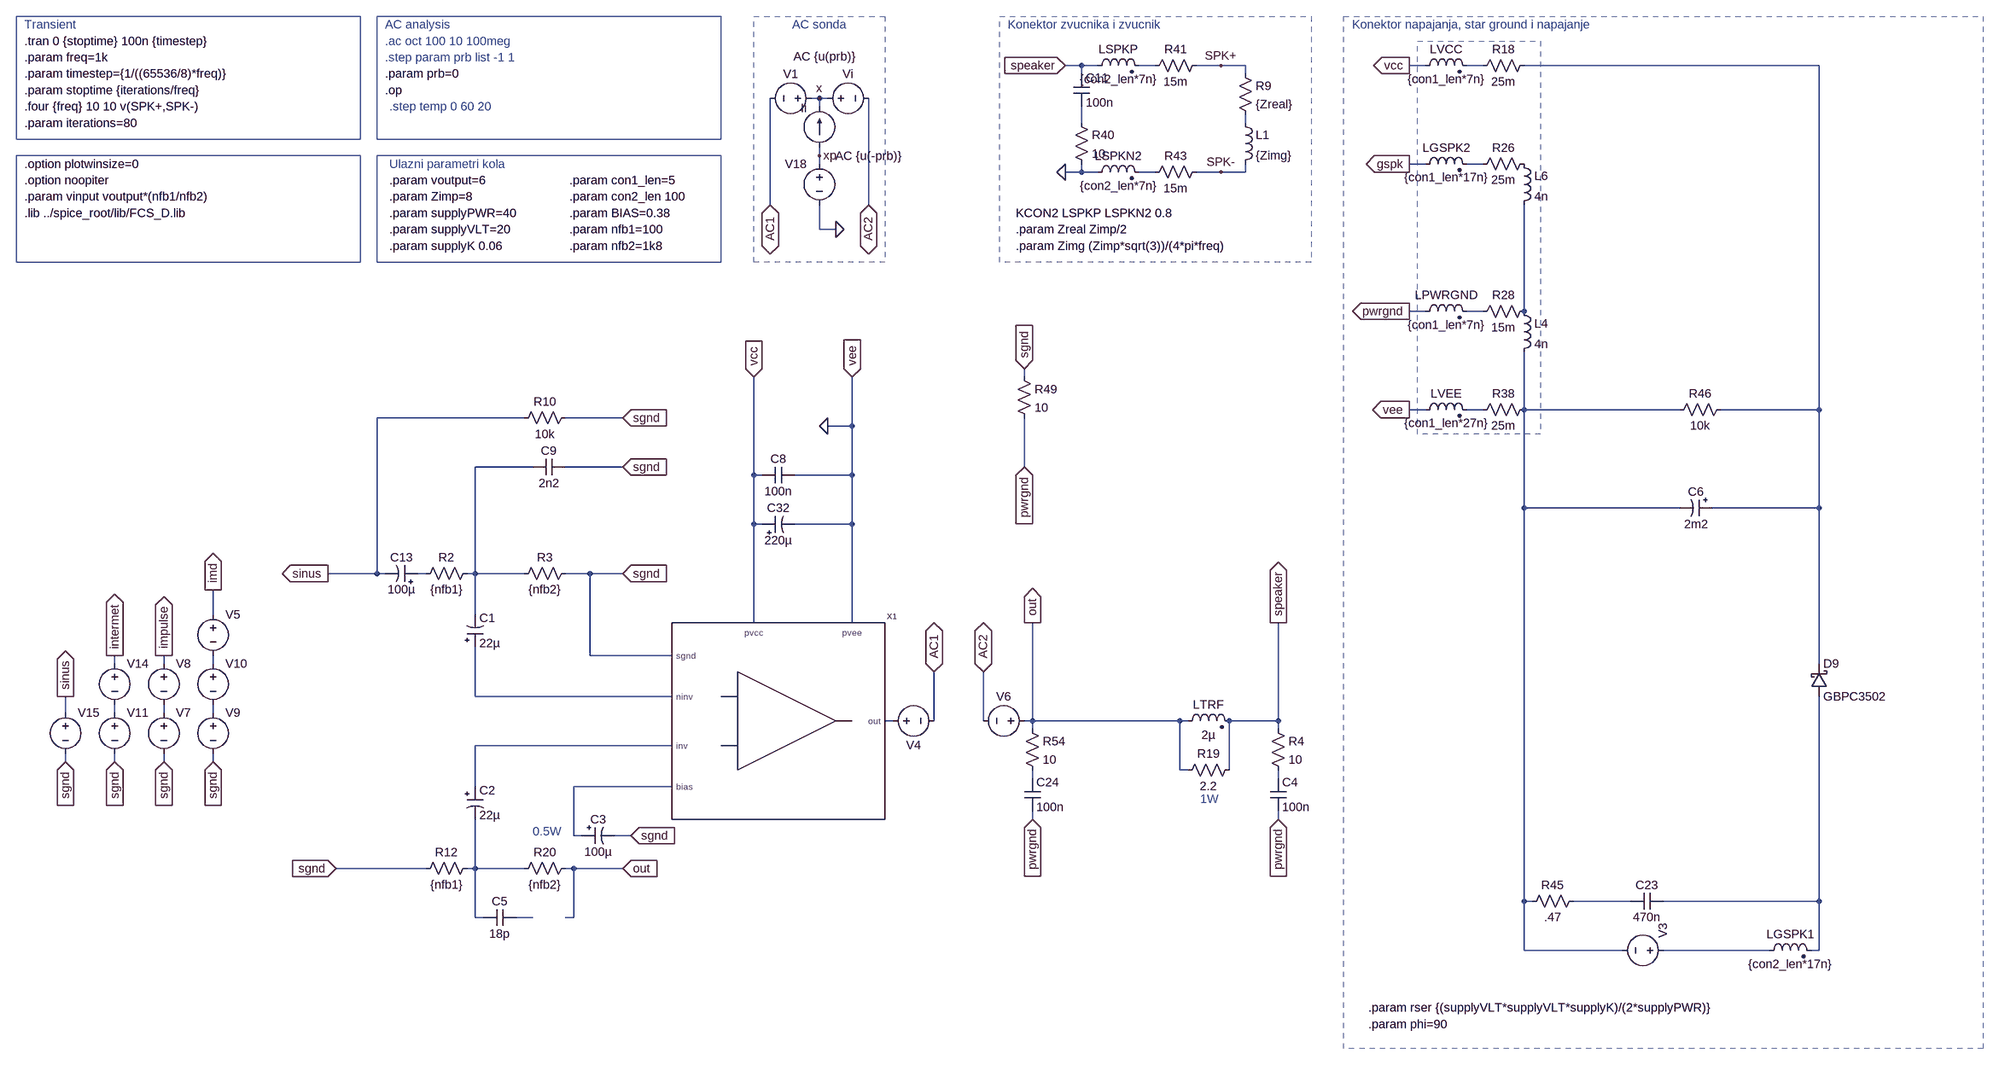
[diagram p0: schematic pab3bbb-sewa.asc]
pab3bbb-sewa.asc, the LTspice schematic file:
Version 4
SHEET 1 6124 2336
WIRE 1504 -1536 1472 -1536
WIRE 1536 -1536 1504 -1536
WIRE 1648 -1536 1616 -1536
WIRE 1776 -1536 1728 -1536
WIRE 1824 -1536 1776 -1536
WIRE 2176 -1536 2144 -1536
WIRE 2288 -1536 2256 -1536
WIRE 2944 -1536 2368 -1536
WIRE 1504 -1520 1504 -1536
WIRE 1824 -1520 1824 -1536
WIRE 992 -1472 976 -1472
WIRE 1008 -1472 992 -1472
WIRE 992 -1456 992 -1472
WIRE 1504 -1424 1504 -1456
WIRE 1824 -1424 1824 -1440
WIRE 992 -1360 992 -1376
WIRE 992 -1344 992 -1360
WIRE 2176 -1344 2144 -1344
WIRE 2288 -1344 2256 -1344
WIRE 1504 -1328 1504 -1344
WIRE 1504 -1328 1472 -1328
WIRE 1536 -1328 1504 -1328
WIRE 1648 -1328 1616 -1328
WIRE 1776 -1328 1728 -1328
WIRE 1824 -1328 1824 -1344
WIRE 1824 -1328 1776 -1328
WIRE 896 -1264 896 -1472
WIRE 1088 -1264 1088 -1472
WIRE 992 -1216 992 -1264
WIRE 1024 -1216 992 -1216
WIRE 2176 -1056 2144 -1056
WIRE 2288 -1056 2256 -1056
WIRE 2368 -1056 2368 -1264
WIRE 1392 -928 1392 -944
WIRE 2176 -864 2144 -864
WIRE 2288 -864 2256 -864
WIRE 2368 -864 2368 -976
WIRE 2672 -864 2368 -864
WIRE 2944 -864 2944 -1536
WIRE 2944 -864 2752 -864
WIRE 416 -848 128 -848
WIRE 608 -848 496 -848
WIRE 1056 -832 1056 -928
WIRE 1056 -832 1008 -832
WIRE 432 -752 320 -752
WIRE 608 -752 496 -752
WIRE 1392 -752 1392 -848
WIRE 864 -736 864 -928
WIRE 880 -736 864 -736
WIRE 1056 -736 1056 -832
WIRE 1056 -736 944 -736
WIRE 2368 -672 2368 -864
WIRE 2672 -672 2368 -672
WIRE 2944 -672 2944 -864
WIRE 2944 -672 2736 -672
WIRE 864 -640 864 -736
WIRE 880 -640 864 -640
WIRE 1056 -640 1056 -736
WIRE 1056 -640 944 -640
WIRE 128 -544 128 -848
WIRE 128 -544 32 -544
WIRE 144 -544 128 -544
WIRE 224 -544 208 -544
WIRE 320 -544 320 -752
WIRE 320 -544 304 -544
WIRE 416 -544 320 -544
WIRE 544 -544 496 -544
WIRE 608 -544 544 -544
WIRE -192 -464 -192 -512
WIRE 320 -464 320 -544
WIRE 864 -448 864 -640
WIRE 1056 -448 1056 -640
WIRE 544 -384 544 -544
WIRE 704 -384 544 -384
WIRE -384 -368 -384 -384
WIRE -288 -368 -288 -384
WIRE -192 -368 -192 -384
WIRE 2944 -368 2944 -672
WIRE 320 -304 320 -400
WIRE 704 -304 320 -304
WIRE -480 -272 -480 -304
WIRE -384 -272 -384 -288
WIRE -288 -272 -288 -288
WIRE -192 -272 -192 -288
WIRE 1136 -256 1120 -256
WIRE 1216 -256 1216 -352
WIRE 1312 -256 1312 -352
WIRE 1408 -256 1408 -448
WIRE 1408 -256 1392 -256
WIRE 1696 -256 1408 -256
WIRE 1712 -256 1696 -256
WIRE 1888 -256 1888 -448
WIRE 1888 -256 1792 -256
WIRE 1408 -240 1408 -256
WIRE 1888 -240 1888 -256
WIRE 704 -208 320 -208
WIRE -480 -176 -480 -192
WIRE -384 -176 -384 -192
WIRE -288 -176 -288 -192
WIRE -192 -176 -192 -192
WIRE 1696 -160 1696 -256
WIRE 1712 -160 1696 -160
WIRE 1792 -160 1792 -256
WIRE 1408 -144 1408 -160
WIRE 1888 -144 1888 -160
WIRE 320 -128 320 -208
WIRE 704 -128 512 -128
WIRE 1408 -64 1408 -80
WIRE 1888 -64 1888 -80
WIRE 512 -32 512 -128
WIRE 528 -32 512 -32
WIRE 624 -32 592 -32
WIRE 224 32 48 32
WIRE 320 32 320 -64
WIRE 320 32 304 32
WIRE 416 32 320 32
WIRE 512 32 496 32
WIRE 608 32 512 32
WIRE 2368 96 2368 -672
WIRE 2384 96 2368 96
WIRE 2576 96 2464 96
WIRE 2944 96 2944 -304
WIRE 2944 96 2640 96
WIRE 320 128 320 32
WIRE 336 128 320 128
WIRE 432 128 400 128
WIRE 512 128 512 32
WIRE 512 128 496 128
WIRE 2368 192 2368 96
WIRE 2560 192 2368 192
WIRE 2848 192 2640 192
WIRE 2944 192 2944 96
WIRE 2944 192 2928 192
FLAG 992 -1472 x
FLAG 1408 -448 out
IOPIN 1408 -448 Out
FLAG 992 -1360 xp
FLAG 1408 -64 pwrgnd
IOPIN 1408 -64 In
FLAG 48 32 sgnd
IOPIN 48 32 In
FLAG -384 -176 sgnd
IOPIN -384 -176 In
FLAG -384 -384 intermet
IOPIN -384 -384 Out
FLAG 2144 -1536 vcc
IOPIN 2144 -1536 Out
FLAG 2144 -864 vee
IOPIN 2144 -864 Out
FLAG 2144 -1344 gspk
IOPIN 2144 -1344 Out
FLAG 2144 -1056 pwrgnd
IOPIN 2144 -1056 Out
FLAG 608 32 out
IOPIN 608 32 In
FLAG 1888 -448 speaker
IOPIN 1888 -448 Out
FLAG 1472 -1536 speaker
IOPIN 1472 -1536 In
FLAG -288 -384 impulse
IOPIN -288 -384 Out
FLAG 896 -1264 AC1
IOPIN 896 -1264 BiDir
FLAG 1088 -1264 AC2
IOPIN 1088 -1264 BiDir
FLAG 1216 -352 AC1
IOPIN 1216 -352 BiDir
FLAG 1312 -352 AC2
IOPIN 1312 -352 BiDir
FLAG 1776 -1536 SPK+
FLAG 1776 -1328 SPK-
FLAG -192 -512 imd
IOPIN -192 -512 Out
FLAG -288 -176 sgnd
IOPIN -288 -176 In
FLAG -192 -176 sgnd
IOPIN -192 -176 In
FLAG 1392 -944 sgnd
IOPIN 1392 -944 In
FLAG 1056 -928 vee
IOPIN 1056 -928 In
FLAG 864 -928 vcc
IOPIN 864 -928 In
FLAG 1024 -1216 0
FLAG 1392 -752 pwrgnd
IOPIN 1392 -752 In
FLAG 1008 -832 0
FLAG 608 -544 sgnd
IOPIN 608 -544 In
FLAG 1472 -1328 0
FLAG 608 -752 sgnd
IOPIN 608 -752 In
FLAG -480 -176 sgnd
IOPIN -480 -176 In
FLAG -480 -304 sinus
IOPIN -480 -304 Out
FLAG 608 -848 sgnd
IOPIN 608 -848 In
FLAG 1888 -64 pwrgnd
IOPIN 1888 -64 In
FLAG 624 -32 sgnd
IOPIN 624 -32 In
FLAG 32 -544 sinus
IOPIN 32 -544 Out
SYMBOL res 320 16 R90
WINDOW 0 0 56 VBottom 2
WINDOW 3 32 56 VTop 2
SYMATTR InstName R12
SYMATTR Value {nfb1}
SYMBOL current 992 -1376 R180
WINDOW 0 24 77 Left 2
WINDOW 3 24 0 Invisible 2
WINDOW 123 -71 178 Left 2
WINDOW 39 0 0 Left 2
SYMATTR InstName Ii
SYMATTR Value 0
SYMATTR Value2 AC {u(prb)}
SYMBOL voltage 992 -1472 R270
WINDOW 0 32 56 VTop 2
WINDOW 3 -32 56 Invisible 2
WINDOW 123 -97 96 VBottom 2
WINDOW 39 -32 56 VBottom 2
SYMATTR InstName Vi
SYMATTR Value 0
SYMATTR Value2 AC {u(-prb)}
SYMBOL ind2 1696 -240 R270
WINDOW 0 32 56 VTop 2
WINDOW 3 4 56 VBottom 2
SYMATTR InstName LTRF
SYMATTR Value 2µ
SYMATTR SpiceLine Rser=10m Rpar=3meg Cpar=1p
SYMATTR Type ind
SYMBOL res 1696 -144 R270
WINDOW 0 32 56 VTop 2
WINDOW 3 0 56 VBottom 2
SYMATTR InstName R19
SYMATTR Value 2.2
SYMBOL res 512 16 R90
WINDOW 0 0 56 VBottom 2
WINDOW 3 32 56 VTop 2
SYMATTR InstName R20
SYMATTR Value {nfb2}
SYMBOL voltage 992 -1472 R90
WINDOW 0 -32 56 VBottom 2
WINDOW 3 32 56 Invisible 2
WINDOW 123 0 0 Left 2
WINDOW 39 0 0 Left 2
SYMATTR InstName V1
SYMATTR Value 0
SYMBOL schottky 2928 -304 M180
WINDOW 3 24 0 Left 2
WINDOW 0 24 64 Left 2
SYMATTR Value GBPC3502
SYMATTR InstName D9
SYMATTR Description Diode
SYMATTR Type diode
SYMBOL voltage 2656 192 M270
WINDOW 123 0 0 Left 2
WINDOW 3 -96 -62 Invisible 2
SYMATTR Value SINE(0 {supplyVLT} 50 1m 0 {phi})
SYMATTR SpiceLine Rser={rser}
SYMATTR InstName V3
SYMBOL res 1392 -256 R0
SYMATTR InstName R54
SYMATTR Value 10
SYMBOL voltage 992 -1360 M0
WINDOW 123 0 0 Left 2
WINDOW 39 0 0 Left 2
WINDOW 3 24 96 Invisible 2
SYMATTR Value 0
SYMATTR InstName V18
SYMBOL cap 1392 -144 R0
SYMATTR InstName C24
SYMATTR Value 100n
SYMATTR SpiceLine Rser=700m Lser=7n Rpar=4.4meg Cpar=1p
SYMBOL ind2 2160 -1520 R270
WINDOW 0 32 56 VTop 2
WINDOW 3 5 56 VBottom 2
SYMATTR InstName LVCC
SYMATTR Value {con1_len*7n}
SYMATTR SpiceLine Rser={con1_len*.5m}
SYMATTR Type ind
SYMBOL ind2 2160 -848 R270
WINDOW 0 32 56 VTop 2
WINDOW 3 5 56 VBottom 2
SYMATTR InstName LVEE
SYMATTR Value {con1_len*27n}
SYMATTR SpiceLine Rser={con1_len*.5m}
SYMATTR Type ind
SYMBOL voltage -384 -288 R0
WINDOW 123 24 44 Left 2
WINDOW 39 0 0 Left 2
WINDOW 3 24 96 Invisible 2
SYMATTR Value SINE(0 {vinput} {freq} 10m 10 0 5)
SYMATTR InstName V11
SYMBOL ind2 2160 -1328 R270
WINDOW 0 32 56 VTop 2
WINDOW 3 5 56 VBottom 2
SYMATTR InstName LGSPK2
SYMATTR Value {con1_len*17n}
SYMATTR SpiceLine Rser={con1_len*.5m}
SYMATTR Type ind
SYMBOL res 2384 -1552 R90
WINDOW 0 0 56 VBottom 2
WINDOW 3 32 56 VTop 2
SYMATTR InstName R18
SYMATTR Value 25m
SYMBOL res 2384 -1360 R90
WINDOW 0 0 56 VBottom 2
WINDOW 3 32 56 VTop 2
SYMATTR InstName R26
SYMATTR Value 25m
SYMBOL res 2384 -1072 R90
WINDOW 0 0 56 VBottom 2
WINDOW 3 32 56 VTop 2
SYMATTR InstName R28
SYMATTR Value 15m
SYMBOL res 2384 -880 R90
WINDOW 0 0 56 VBottom 2
WINDOW 3 32 56 VTop 2
SYMATTR InstName R38
SYMATTR Value 25m
SYMBOL ind 2352 -1072 R0
SYMATTR InstName L4
SYMATTR Value 4n
SYMATTR SpiceLine Rser=1m
SYMBOL ind 2352 -1360 R0
SYMATTR InstName L6
SYMATTR Value 4n
SYMATTR SpiceLine Rser=1m
SYMBOL ind2 1520 -1520 R270
WINDOW 0 32 56 VTop 2
WINDOW 3 5 56 VBottom 2
SYMATTR InstName LSPKP
SYMATTR Value {con2_len*7n}
SYMATTR SpiceLine Rser={con2_len*.5m}
SYMATTR Type ind
SYMBOL ind2 1520 -1312 R270
WINDOW 0 32 56 VTop 2
WINDOW 3 5 56 VBottom 2
SYMATTR InstName LSPKN2
SYMATTR Value {con2_len*7n}
SYMATTR SpiceLine Rser={con2_len*.5m}
SYMATTR Type ind
SYMBOL res 1744 -1552 R90
WINDOW 0 0 56 VBottom 2
WINDOW 3 32 56 VTop 2
SYMATTR InstName R41
SYMATTR Value 15m
SYMBOL res 1744 -1344 R90
WINDOW 0 0 56 VBottom 2
WINDOW 3 32 56 VTop 2
SYMATTR InstName R43
SYMATTR Value 15m
SYMBOL voltage -288 -288 R0
WINDOW 3 24 96 Invisible 2
WINDOW 123 0 0 Left 2
WINDOW 39 0 0 Left 2
SYMATTR Value PULSE(0 {vinput} 1u 1n 1n {1/(freq*2)} {1/freq})
SYMATTR InstName V7
SYMBOL voltage -288 -384 R0
WINDOW 3 24 96 Invisible 2
WINDOW 123 0 0 Left 2
WINDOW 39 0 0 Left 2
SYMATTR Value PULSE(0 {-vinput} {1u+(1/(freq*2))} 1n 1n {1/(freq*2)} {1/freq})
SYMATTR InstName V8
SYMBOL voltage 1120 -256 R270
WINDOW 0 -32 56 VBottom 2
WINDOW 3 32 56 Invisible 2
WINDOW 123 0 0 Left 2
WINDOW 39 0 0 Left 2
SYMATTR InstName V4
SYMATTR Value 0
SYMBOL voltage 1408 -256 R90
WINDOW 0 -32 56 VBottom 2
WINDOW 3 32 56 Invisible 2
WINDOW 123 0 0 Left 2
WINDOW 39 0 0 Left 2
SYMATTR InstName V6
SYMATTR Value 0
SYMBOL voltage -192 -288 R0
WINDOW 3 24 96 Invisible 2
WINDOW 123 0 0 Left 2
WINDOW 39 0 0 Left 2
SYMATTR Value SINE(0 {vinput/3} 19k)
SYMATTR InstName V9
SYMBOL voltage -192 -384 R0
WINDOW 3 24 96 Invisible 2
WINDOW 123 0 0 Left 2
WINDOW 39 0 0 Left 2
SYMATTR Value SINE(0 {vinput/3} 20k 0 0)
SYMATTR InstName V10
SYMBOL cap 2576 80 M90
WINDOW 0 0 32 VBottom 2
WINDOW 3 32 32 VTop 2
SYMATTR InstName C23
SYMATTR Value 470n
SYMATTR SpiceLine Rser=700m Lser=7n Rpar=4.4meg Cpar=1p
SYMBOL polcap 2736 -688 R90
WINDOW 0 0 32 VBottom 2
WINDOW 3 32 32 VTop 2
SYMATTR InstName C6
SYMATTR Value 2m2
SYMATTR SpiceLine V=50 Irms=2.5 Rser=0.085 Lser=20n Rpar=40k Cpar=3p
SYMATTR Description Capacitor
SYMATTR Type cap
SYMBOL res 2768 -880 R90
WINDOW 0 0 56 VBottom 2
WINDOW 3 32 56 VTop 2
SYMATTR InstName R46
SYMATTR Value 10k
SYMBOL polcap 880 -624 R270
WINDOW 0 32 32 VTop 2
WINDOW 3 0 32 VBottom 2
SYMATTR InstName C32
SYMATTR Value 220µ
SYMATTR SpiceLine V=63 Irms=2.77 Rser=0.070 Lser=4n Rpar=1900k Cpar=3p
SYMATTR Description Capacitor
SYMATTR Type cap
SYMBOL res 1376 -944 R0
SYMATTR InstName R49
SYMATTR Value 10
SYMBOL cap 1488 -1520 R0
SYMATTR InstName C11
SYMATTR Value 100n
SYMBOL res 1488 -1440 R0
SYMATTR InstName R40
SYMATTR Value 10
SYMBOL res 2480 80 R90
WINDOW 0 0 56 VBottom 2
WINDOW 3 32 56 VTop 2
SYMATTR InstName R45
SYMATTR Value .47
SYMBOL pab3bbb-sewa-module 912 -256 R0
SYMATTR InstName X1
SYMBOL res 320 -560 R90
WINDOW 0 0 56 VBottom 2
WINDOW 3 32 56 VTop 2
SYMATTR InstName R2
SYMATTR Value {nfb1}
SYMBOL res 512 -560 R90
WINDOW 0 0 56 VBottom 2
WINDOW 3 32 56 VTop 2
SYMATTR InstName R3
SYMATTR Value {nfb2}
SYMBOL polcap 208 -528 M270
WINDOW 0 32 32 VTop 2
WINDOW 3 0 32 VBottom 2
SYMATTR InstName C13
SYMATTR Value 100µ
SYMATTR SpiceLine V=6.3 Irms=1.44 Rser=0.09 Lser=5.5n Rpar=1110k Cpar=3p
SYMATTR Description Capacitor
SYMATTR Type cap
SYMBOL cap 944 -752 R90
WINDOW 0 0 32 VBottom 2
WINDOW 3 32 32 VTop 2
SYMATTR InstName C8
SYMATTR Value 100n
SYMATTR SpiceLine Rser=700m Lser=7n Rpar=4.4meg Cpar=1p
SYMBOL voltage -192 -480 R0
WINDOW 3 24 96 Invisible 2
WINDOW 123 0 0 Left 2
WINDOW 39 0 0 Left 2
SYMATTR Value SINE(0 {vinput/3} 60 0 0)
SYMATTR InstName V5
SYMBOL ind2 2160 -1040 R270
WINDOW 0 32 56 VTop 2
WINDOW 3 5 56 VBottom 2
SYMATTR InstName LPWRGND
SYMATTR Value {con1_len*7n}
SYMATTR SpiceLine Rser={con1_len*.5m}
SYMATTR Type ind
SYMBOL cap 496 -768 R90
WINDOW 0 0 32 VBottom 2
WINDOW 3 32 32 VTop 2
SYMATTR InstName C9
SYMATTR Value 2n2
SYMBOL voltage -384 -384 R0
WINDOW 123 24 44 Left 2
WINDOW 39 0 0 Left 2
WINDOW 3 24 96 Invisible 2
SYMATTR Value SINE(0 {vinput} {freq} 310m 10 0 5)
SYMATTR InstName V14
SYMBOL voltage -480 -288 R0
WINDOW 123 24 44 Left 2
WINDOW 39 0 0 Left 2
WINDOW 3 24 96 Invisible 2
SYMATTR Value SINE(0 {vinput} {freq} 0 0 0 0)
SYMATTR InstName V15
SYMBOL res 1808 -1536 R0
SYMATTR InstName R9
SYMATTR Value {Zreal}
SYMBOL ind 1808 -1440 R0
SYMATTR InstName L1
SYMATTR Value {Zimg}
SYMBOL res 512 -864 R90
WINDOW 0 0 56 VBottom 2
WINDOW 3 32 56 VTop 2
SYMATTR InstName R10
SYMATTR Value 10k
SYMBOL cap 400 112 R90
WINDOW 0 0 32 VBottom 2
WINDOW 3 32 32 VTop 2
SYMATTR InstName C5
SYMATTR Value 18p
SYMBOL res 1872 -256 R0
SYMATTR InstName R4
SYMATTR Value 10
SYMBOL cap 1872 -144 R0
SYMATTR InstName C4
SYMATTR Value 100n
SYMATTR SpiceLine Rser=700m Lser=7n Rpar=4.4meg Cpar=1p
SYMBOL ind2 2832 208 R270
WINDOW 0 32 56 VTop 2
WINDOW 3 5 56 VBottom 2
SYMATTR InstName LGSPK1
SYMATTR Value {con2_len*17n}
SYMATTR SpiceLine Rser={con2_len*.5m}
SYMATTR Type ind
SYMBOL polcap 304 -400 M180
WINDOW 0 24 57 Left 2
WINDOW 3 24 8 Left 2
SYMATTR InstName C1
SYMATTR Value 22µ
SYMATTR SpiceLine V=6.3 Irms=1.44 Rser=0.09 Lser=5.5n Rpar=1110k Cpar=3p
SYMATTR Description Capacitor
SYMATTR Type cap
SYMBOL polcap 304 -128 R0
SYMATTR InstName C2
SYMATTR Value 22µ
SYMATTR SpiceLine V=6.3 Irms=1.44 Rser=0.09 Lser=5.5n Rpar=1110k Cpar=3p
SYMATTR Description Capacitor
SYMATTR Type cap
SYMBOL polcap 528 -48 M90
WINDOW 0 0 32 VBottom 2
WINDOW 3 32 32 VTop 2
SYMATTR InstName C3
SYMATTR Value 100µ
SYMATTR SpiceLine V=6.3 Irms=1.44 Rser=0.09 Lser=5.5n Rpar=1110k Cpar=3p
SYMATTR Description Capacitor
SYMATTR Type cap
TEXT 144 -1488 Left 2 !.op
TEXT -560 -1344 Left 2 !.option plotwinsize=0
TEXT -560 -1312 Left 2 !.option noopiter
TEXT -560 -1616 Left 2 ;Transient
TEXT -560 -1456 Left 2 !.four {freq} 10 10 v(SPK+,SPK-)
TEXT 144 -1520 Left 2 !.param prb=0
TEXT -560 -1520 Left 2 !.param timestep={1/((65536/8)*freq)}
TEXT -560 -1552 Left 2 !.param freq=1k
TEXT -560 -1488 Left 2 !.param stoptime {iterations/freq}
TEXT 144 -1584 Left 2 ;.ac oct 100 10 100meg
TEXT 144 -1552 Left 2 ;.step param prb list -1 1
TEXT 144 -1616 Left 2 ;AC analysis
TEXT -560 -1424 Left 2 !.param iterations=80
TEXT 152 -1280 Left 2 !.param Zimp=8
TEXT 1376 -1216 Left 2 !.param Zreal Zimp/2
TEXT 1376 -1184 Left 2 !.param Zimg (Zimp*sqrt(3))/(4*pi*freq)
TEXT 152 -1248 Left 2 !.param supplyPWR=40
TEXT 152 -1216 Left 2 !.param supplyVLT=20
TEXT 152 -1312 Left 2 !.param voutput=6
TEXT 152 -1184 Left 2 !.param supplyK 0.06
TEXT 2064 304 Left 2 !.param rser {(supplyVLT*supplyVLT*supplyK)/(2*supplyPWR)}
TEXT -560 -1584 Left 2 !.tran 0 {stoptime} 100n {timestep}
TEXT 2064 336 Left 2 !.param phi=90
TEXT 504 -1312 Left 2 !.param con1_len=5
TEXT 504 -1280 Left 2 !.param con2_len 100
TEXT 1376 -1248 Left 2 !KCON2 LSPKP LSPKN2 0.8
TEXT 1360 -1616 Left 2 ;Konektor zvucnika i zvucnik
TEXT 2032 -1616 Left 2 ;Konektor napajanja, star ground i napajanje
TEXT 152 -1344 Left 2 ;Ulazni parametri kola
TEXT 992 -1616 Center 2 ;AC sonda
TEXT -560 -1248 Left 2 !.lib ../spice_root/lib/FCS_D.lib
TEXT 504 -1248 Left 2 !.param BIAS=0.38
TEXT -560 -1280 Left 2 !.param vinput voutput*(nfb1/nfb2)
TEXT 504 -1216 Left 2 !.param nfb1=100
TEXT 504 -1184 Left 2 !.param nfb2=1k8
TEXT 432 -40 Left 2 ;0.5W
TEXT 1736 -104 Left 2 ;1W
TEXT 152 -1456 Left 2 ;.step temp 0 60 20
RECTANGLE Normal 96 -1632 -576 -1392
RECTANGLE Normal 96 -1152 -576 -1360
RECTANGLE Normal 800 -1632 128 -1392
RECTANGLE Normal 1952 -1152 1344 -1632 2
RECTANGLE Normal 1120 -1152 864 -1632 2
RECTANGLE Normal 2400 -816 2160 -1584 2
RECTANGLE Normal 800 -1152 128 -1360
RECTANGLE Normal 3264 384 2016 -1632 2

The netlist it stands for:
* pab3bbb-sewa.asc
R12 N024 sgnd {nfb1}
Ii xp x 0 AC {u(prb)}
Vi x AC2 0 AC {u(-prb)}
LTRF out speaker 2µ Rser=10m Rpar=3meg Cpar=1p
R19 out speaker 2.2
R20 out N024 {nfb2}
V1 x AC1 0
D9 N026 N003 GBPC3502
V3 N028 N011 SINE(0 {supplyVLT} 50 1m 0 {phi}) Rser={rser}
R54 out N021 10
V18 xp 0 0
C24 N021 pwrgnd 100n Rser=700m Lser=7n Rpar=4.4meg Cpar=1p
LVCC vcc N002 {con1_len*7n} Rser={con1_len*.5m}
LVEE 0 N010 {con1_len*27n} Rser={con1_len*.5m}
V11 N016 sgnd SINE(0 {vinput} {freq} 10m 10 0 5)
LGSPK2 gspk N006 {con1_len*17n} Rser={con1_len*.5m}
R18 N003 N002 25m
R26 P001 N006 25m
R28 N009 N008 15m
R38 N011 N010 25m
L4 N009 N011 4n Rser=1m
L6 P001 N009 4n Rser=1m
LSPKP speaker N001 {con2_len*7n} Rser={con2_len*.5m}
LSPKN2 0 N007 {con2_len*7n} Rser={con2_len*.5m}
R41 SPK+ N001 15m
R43 SPK- N007 15m
V7 N017 sgnd PULSE(0 {vinput} 1u 1n 1n {1/(freq*2)} {1/freq})
V8 impulse N017 PULSE(0 {-vinput} {1u+(1/(freq*2))} 1n 1n {1/(freq*2)} {1/freq})
V4 N019 AC1 0
V6 out AC2 0
V9 N018 sgnd SINE(0 {vinput/3} 19k)
V10 N014 N018 SINE(0 {vinput/3} 20k 0 0)
C23 N025 N026 470n Rser=700m Lser=7n Rpar=4.4meg Cpar=1p
C6 N003 N011 2m2 V=50 Irms=2.5 Rser=0.085 Lser=20n Rpar=40k Cpar=3p
R46 N003 N011 10k
C32 vcc 0 220µ V=63 Irms=2.77 Rser=0.070 Lser=4n Rpar=1900k Cpar=3p
R49 sgnd pwrgnd 10
C11 speaker N004 100n
R40 N004 0 10
R45 N025 N011 .47
XX1 N015 N020 N019 0 vcc sgnd N023 pab3bbb-sewa-module  ; pins ninv inv out pvee pvcc sgnd bias
R2 N012 N013 {nfb1}
R3 sgnd N012 {nfb2}
C13 N013 sinus 100µ V=6.3 Irms=1.44 Rser=0.09 Lser=5.5n Rpar=1110k Cpar=3p
C8 0 vcc 100n Rser=700m Lser=7n Rpar=4.4meg Cpar=1p
V5 imd N014 SINE(0 {vinput/3} 60 0 0)
LPWRGND pwrgnd N008 {con1_len*7n} Rser={con1_len*.5m}
C9 sgnd N012 2n2
V14 intermet N016 SINE(0 {vinput} {freq} 310m 10 0 5)
V15 sinus sgnd SINE(0 {vinput} {freq} 0 0 0 0)
R9 SPK+ N005 {Zreal}
L1 N005 SPK- {Zimg}
R10 sgnd sinus 10k
C5 N027 N024 18p
R4 speaker N022 10
C4 N022 pwrgnd 100n Rser=700m Lser=7n Rpar=4.4meg Cpar=1p
LGSPK1 N028 N026 {con2_len*17n} Rser={con2_len*.5m}
C1 N015 N012 22µ V=6.3 Irms=1.44 Rser=0.09 Lser=5.5n Rpar=1110k Cpar=3p
C2 N020 N024 22µ V=6.3 Irms=1.44 Rser=0.09 Lser=5.5n Rpar=1110k Cpar=3p
C3 N023 sgnd 100µ V=6.3 Irms=1.44 Rser=0.09 Lser=5.5n Rpar=1110k Cpar=3p
.model D D
.lib standard.dio
.op
.option plotwinsize=0
.option noopiter
* Transient
.four {freq} 10 10 v(SPK+,SPK-)
.param prb=0
.param timestep={1/((65536/8)*freq)}
.param freq=1k
.param stoptime {iterations/freq}
* .ac oct 100 10 100meg
* .step param prb list -1 1
* AC analysis
.param iterations=80
.param Zimp=8
.param Zreal Zimp/2
.param Zimg (Zimp*sqrt(3))/(4*pi*freq)
.param supplyPWR=40
.param supplyVLT=20
.param voutput=6
.param supplyK 0.06
.param rser {(supplyVLT*supplyVLT*supplyK)/(2*supplyPWR)}
.tran 0 {stoptime} 100n {timestep}
.param phi=90
.param con1_len=5
.param con2_len 100
KCON2 LSPKP LSPKN2 0.8
* Konektor zvucnika i zvucnik
* Konektor napajanja, star ground i napajanje
* Ulazni parametri kola
* AC sonda
.lib ../spice_root/lib/FCS_D.lib
.param BIAS=0.38
.param vinput voutput*(nfb1/nfb2)
.param nfb1=100
.param nfb2=1k8
* 0.5W
* 1W
* .step temp 0 60 20
.backanno
.end